# EAGLE design Linear Power Supply 5V (EAGLE 9.6.2)
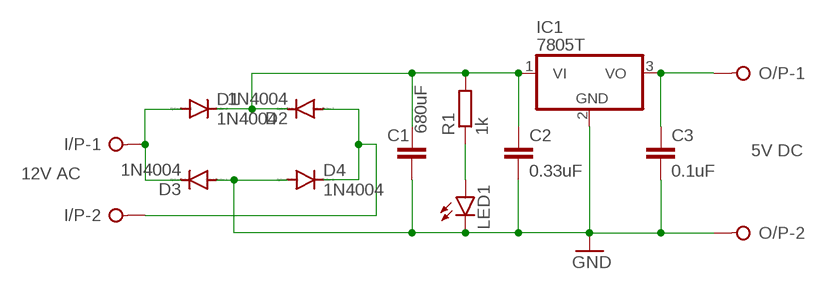
[diagram p0: schematic, sheet 1]

## Parts
C1  680uF  C-EU025-060X050  [C025-060X050]
C2  0.33uF  C-EU025-060X050  [C025-060X050]
C3  0.1uF  C-EU025-060X050  [C025-060X050]
D1  1N4004  [DO41-10]
D2  1N4004  [DO41-10]
D3  1N4004  [DO41-10]
D4  1N4004  [DO41-10]
I/P  12V AC  W237-02P  [W237-132]
IC1  7805T  [TO220H]
LED1  LED3MM  [LED3MM]
O/P  5V DC  W237-02P  [W237-132]
R1  1k  R-EU_0207/12  [0207/12]

## Nets
GND: C1.2 C2.2 C3.2 D3.A D4.A IC1.2(GND) LED1.K(C) O/P.2
N$1: D1.A D3.C I/P.1
N$2: C1.1 C2.1 D1.C D2.C IC1.1(VI) R1.2
N$3: LED1.A R1.1
N$4: C3.1 IC1.3(VO) O/P.1
N$5: D2.A D4.C I/P.2

## Library data of the parts
C1-C3 = rcl:C-EU: CAPACITOR, European symbol; SPICEPREFIX: C
D1-D4 = diode:1N4004: DIODE general purpose rectifier, 1 A
I/P O/P = con-wago-508:W237-02P: WAGO SREW CLAMP; OC_FARNELL: unknown; OC_NEWARK: unknown
IC1 = linear:78*: Positive VOLTAGE REGULATOR Source: http://cache.national.com/ds/LM/LM78L05.pdf http://www.fairchildsemi.com/ds/LM/LM7805.pdf
LED1 = led:LED: LED OSRAM: - CHIPLED LG R971, LG N971, LY N971, LG Q971, LY Q971, LO R971, LY R971 LH N974, LH R974 LS Q976, LO Q976, LY Q976 LO Q996 - Hyper CHIPLED LW Q18S LB Q993, LB Q99A, LB R99A - SideLED LS A670, LO A670, LY A670, LG A670, LP A670 LB A673, LV A673, LT A673, LW A673 LH A674 LY A675 LS A676, LA A676, LO A676, LY A676, LW A676 LS A679, LY A679, LG A679 - Hyper Micro SIDELED® LS Y876, LA Y876, LO Y876, LY Y876 LT Y87S - SmartLED LW L88C, LW L88S LB L89C, LB L89S, LG L890 LS L89K, LO L89K, LY L89K LS L896, LA L896, LO L896, LY L896 - TOPLED LS T670, LO T670, LY T670, LG T670, LP T670 LSG T670, LSP T670, LSY T670, LOP T670, LYG T670 LG T671, LOG T671, LSG T671 LB T673, LV T673, LT T673, LW T673 LH T674 LS T676, LA T676, LO T676, LY T676, LB T676, LH T676, LSB T676, LW T676 LB T67C, LV T67C, LT T67C, LS T67K, LO T67K, LY T67K, LW E67C LS E67B, LA E67B, LO E67B, LY E67B, LB E67C, LV E67C, LT E67C LW T67C LS T679, LY T679, LG T679 LS T770, LO T770, LY T770, LG T770, LP T770 LB T773, LV T773, LT T773, LW T773 LH T774 LS E675, LA E675, LY E675, LS T675 LS T776, LA T776, LO T776, LY T776, LB T776 LHGB T686 LT T68C, LB T68C - Hyper Mini TOPLED® LB M676 - Mini TOPLED Santana® LG M470 LS M47K, LO M47K, LY M47K Source: http://www.osram.convergy.de LUXEON: - LUMILED® LXK2-PW12-R00, LXK2-PW12-S00, LXK2-PW14-U00, LXK2-PW14-V00 LXK2-PM12-R00, LXK2-PM12-S00, LXK2-PM14-U00 LXK2-PE12-Q00, LXK2-PE12-R00, LXK2-PE12-S00, LXK2-PE14-T00, LXK2-PE14-U00 LXK2-PB12-K00, LXK2-PB12-L00, LXK2-PB12-M00, LXK2-PB14-N00, LXK2-PB14-P00, LXK2-PB14-Q00 LXK2-PR12-L00, LXK2-PR12-M00, LXK2-PR14-Q00, LXK2-PR14-R00 LXK2-PD12-Q00, LXK2-PD12-R00, LXK2-PD12-S00 LXK2-PH12-R00, LXK2-PH12-S00 LXK2-PL12-P00, LXK2-PL12-Q00, LXK2-PL12-R00 Source: www.luxeon.com KINGBRIGHT: KA-3528ASYC Source: www.kingbright.com
R1 = rcl:R-EU_: RESISTOR, European symbol; SPICEPREFIX: R

## Board
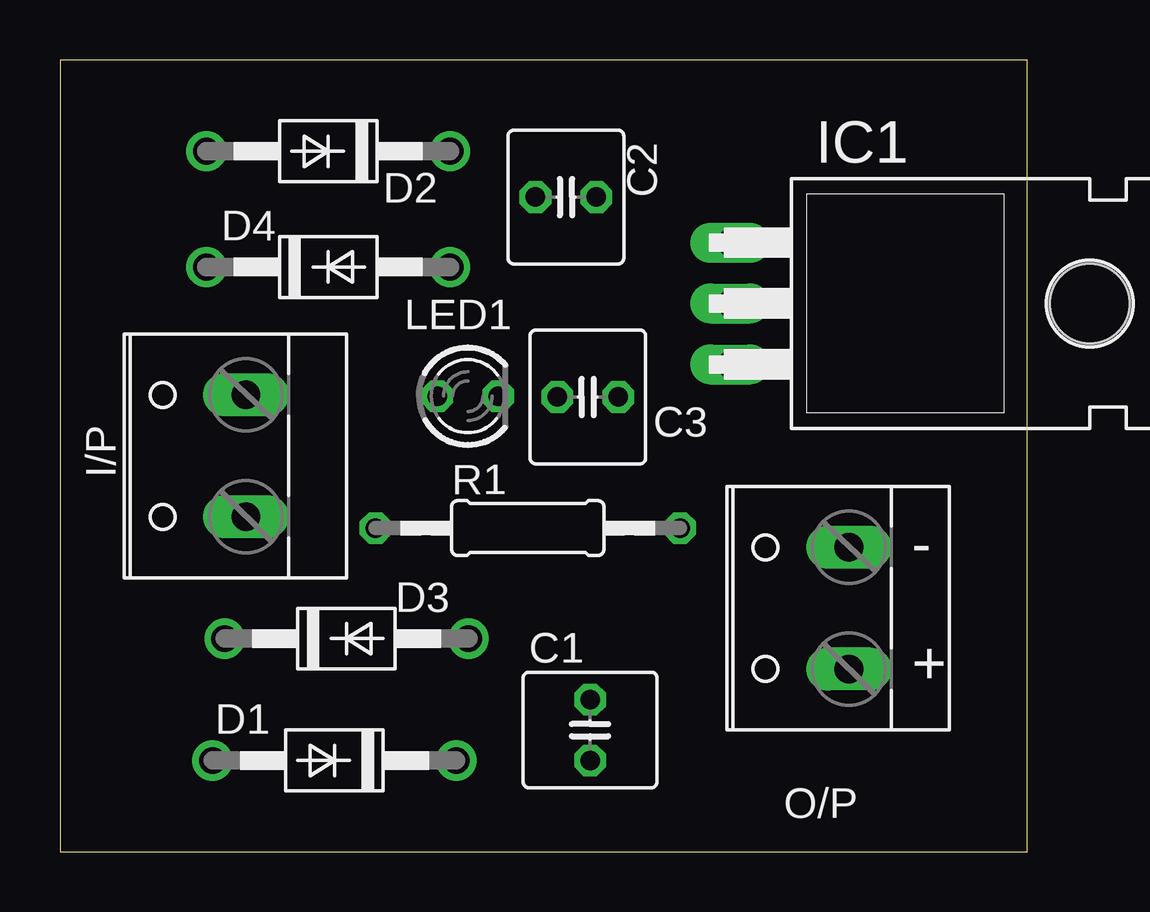
[diagram p1: board, top side]
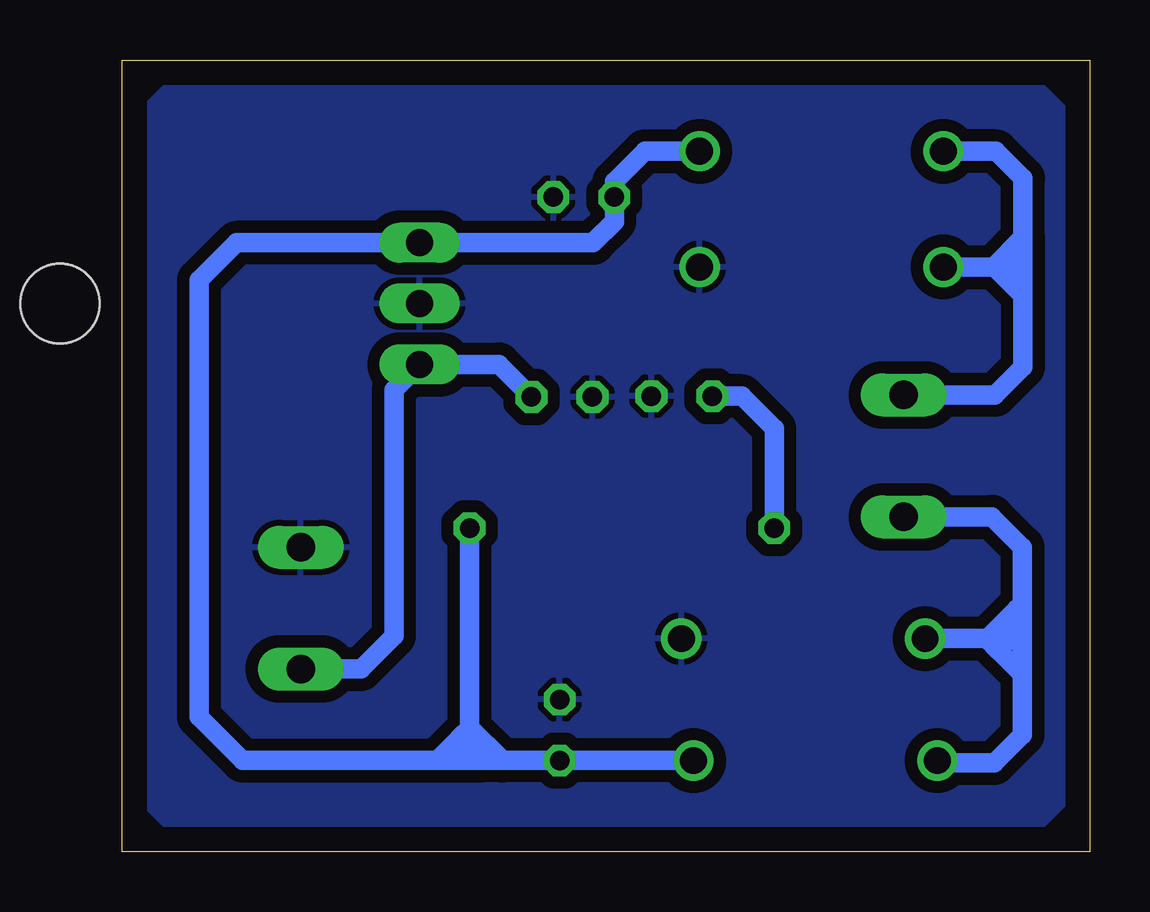
[diagram p2: board, bottom side, seen from below]

Size 40.33 x 33.01 mm. Coordinates in mm from the lower left corner, seen from the top.
Outline: 0,0 40.33,0.01 40.33,33.02 0,33.01 0,0
Copper layers (1*16): Top 0.035mm / dielectric 1.5mm / Bottom 0.035mm
Design rules "default *": minimum track width 10mil, minimum drill 24mil, track to track 20mil, track to pad 20mil, pad to pad 20mil, via to via 20mil, smd to smd 8mil, copper to edge 40mil, drill to drill 8mil, minimum pad ring 10mil, minimum via ring 8mil, stop-mask expansion 4mil, vias tented up to drill 0mil, thermal gap 10mil

### Footprints (pad centres in the part's own frame; a part is rotated, then mirrored left to right if it is on the bottom)
C025-060X050 = drill 0.813 octagon: 1 -1.27,0; 2 1.27,0
DO41-10 = drill 1.118: A 5.08,0; C -5.08,0
W237-132 = drill 1.194 long: 1 -2.54,-0.635; 2 2.54,-0.635
TO220H = drill 1.118 long: 1 -2.54,-10.16; 2 0,-10.16; 3 2.54,-10.16 | hole 3.302: 0,4.826
LED3MM = drill 0.813 octagon: A -1.27,0; K 1.27,0
0207/12 = drill 0.813 octagon: 1 -6.35,0; 2 6.35,0

### Placement (x,y rotation side)
C1  22.1,5.08 90 top
C2  21.09,27.3 0 top
C3  22,18.97 180 top
D1  11.44,3.81 180 top
D2  11.18,29.21 180 top
D3  11.95,8.89 0 top
D4  11.18,24.38 0 top
I/P  7.12,16.51 90 top
IC1  38.1,22.86 270 top
LED1  17,19 0 top
O/P  32.25,10.16 90 top
R1  19.5,13.5 0 top

### Tracks (layer width: path | path; a pad name or v marks a point on that pad's centre or on a via)
GND
  pour Bottom: 1,31 1,2 2,1 38.5,1 39.5,2 39.5,31 38.5,32 2,32
N$1
  Bottom 0.813: I/P.1 4.08,13.97 2.81,12.7 2.81,10.36 | D1.A 6.26,3.71 3.98,3.71 2.81,4.88 2.81,7.4 | D3.C 4.28,8.89 | 2.81,10.36 2.81,7.4 | 2.81,10.36 3.04,10.13 | 3.04,10.13 4.28,8.89 | 4.28,8.89 4.28,8.87 3.81,8.39 | 3.81,8.39 2.81,7.4 | 3.04,10.13 3.04,9.16 3.81,8.39
N$2
  Bottom 0.813: D2.C 18.55,29.21 19.82,27.94 C2.1 19.82,26.28 20.7,25.4 IC1.1 35.56,25.4 37.13,23.83 37.13,5.63 35.31,3.81 27.2,3.81 | D1.C C1.1 24.48,3.81 | 25.85,5.18 25.85,5.16 26.3,4.71 | 25.85,5.18 R1.2 | 24.48,3.81 25.85,5.18 | 27.2,3.81 26.3,4.71 | 24.48,3.81 25.41,3.81 | 25.41,3.81 26.3,4.71 | 27.2,3.81 25.41,3.81
N$3
  Bottom 0.813: R1.1 13.15,17.65 14.5,19 LED1.A
N$4
  Bottom 0.813: C3.1 24.63,20.32 IC1.3 29,19.26 29,9 30.38,7.62 O/P.1
N$5
  Bottom 0.813: D2.A 3.91,29.21 2.78,28.08 2.78,25.6 | 2.78,23.18 2.78,20.22 3.95,19.05 I/P.2 | D4.C 3.98,24.38 | 2.78,23.18 3.98,24.38 | 2.78,25.6 2.78,24.4 | 3.98,24.38 3.98,24.4 2.78,25.6 | 2.78,24.4 2.78,23.18 | 3.98,24.38 3.97,24.4 2.78,24.4

### Text on the board
tNames: - | +